# EAGLE design 12F629_prog (EAGLE 9.5.2)
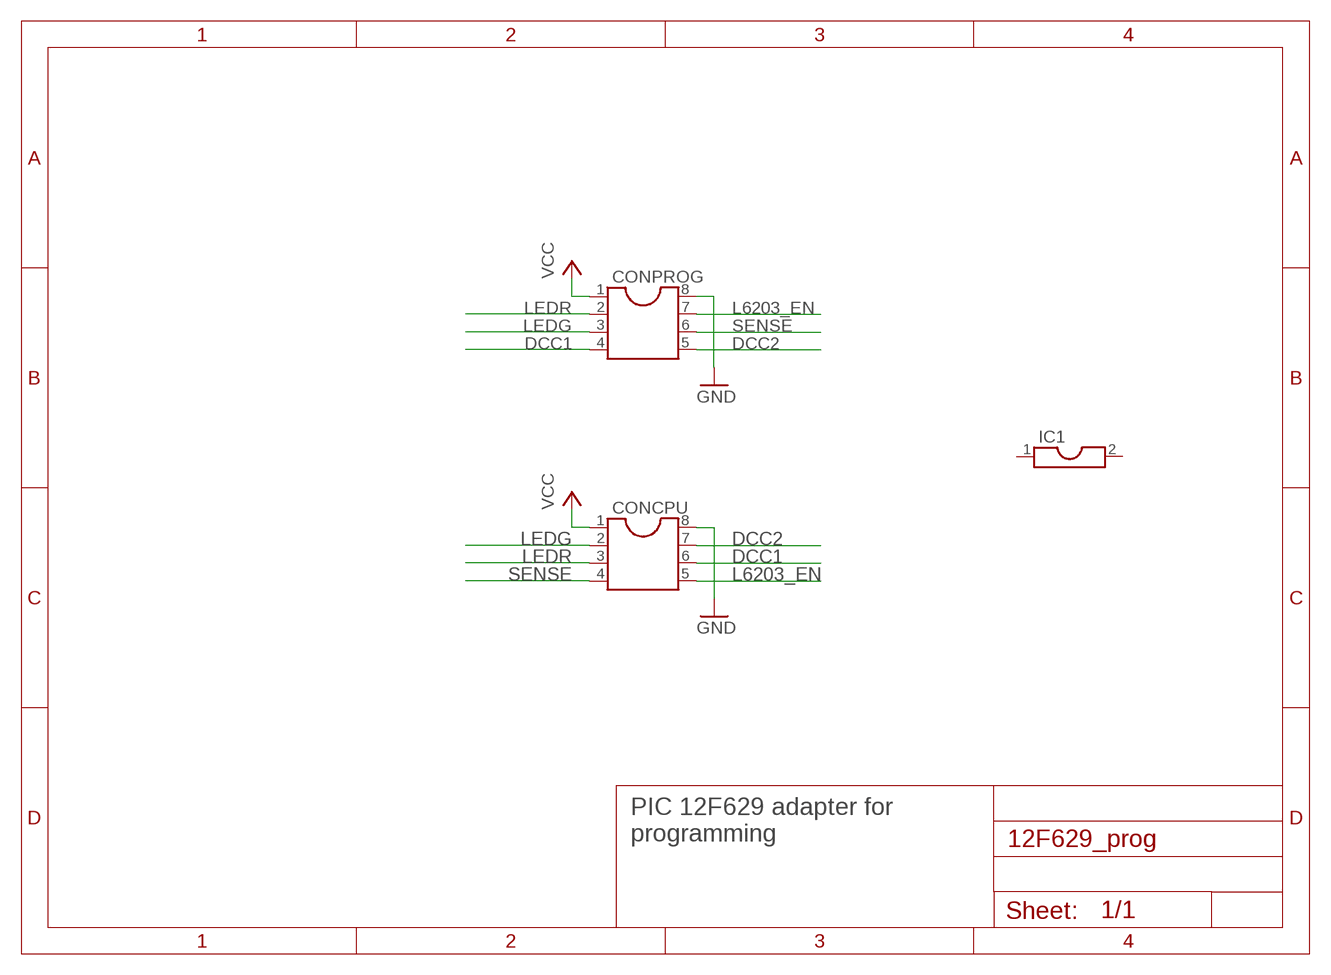
[diagram p0: schematic, sheet 1]

## Parts
CONCPU  DIL8  [DIL08]
CONPROG  DIL8  [DIL08]
IC1  DIL2  [DIL02]

## Nets
DCC1: CONCPU.6 CONPROG.4
DCC2: CONCPU.7 CONPROG.5
GND: CONCPU.8 CONPROG.8
L6203_EN: CONCPU.5 CONPROG.7
LEDG: CONCPU.2 CONPROG.3
LEDR: CONCPU.3 CONPROG.2
SENSE: CONCPU.4 CONPROG.6
VCC: CONCPU.1 CONPROG.1
Unconnected: IC1.1 IC1.2

## Notes on the sheet
- PIC 12F629 adapter for
  programming

## Library data of the parts
CONCPU CONPROG = ic-package-edited:DIL8: Dual In Line / Socket
IC1 = ic-package-edited:DIL2: Dual In Line

## Net classes
0 default: width 0.305 mm

## Board
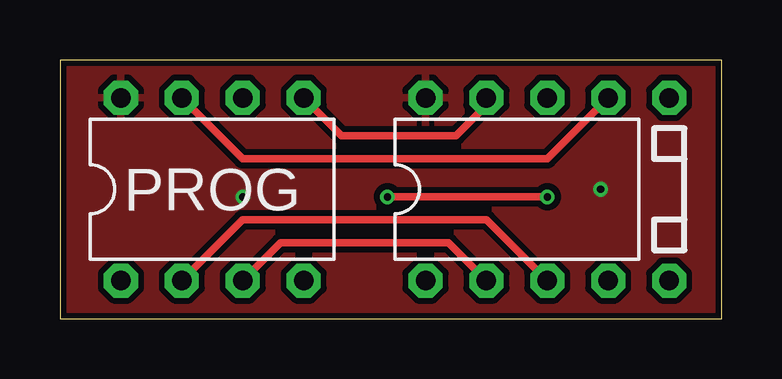
[diagram p1: board, top side]
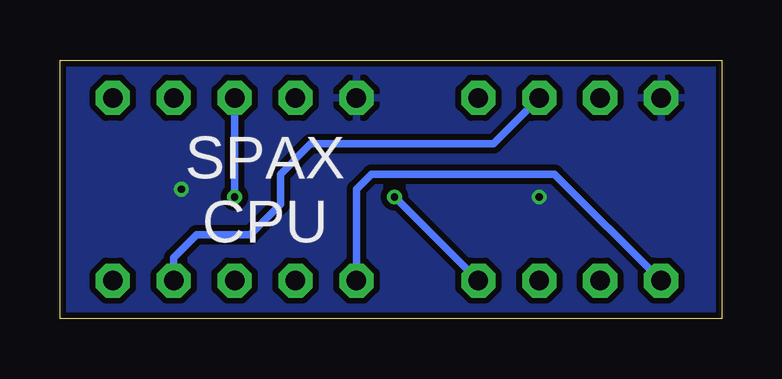
[diagram p2: board, bottom side, seen from below]

Size 27.6 x 10.78 mm. Coordinates in mm from the lower left corner, seen from the top.
Outline: 0,0 27.6,0 27.6,10.78 0,10.78 0,0
Copper layers (1*16): Top 0.035mm / dielectric 1.5mm / Bottom 0.035mm
Design rules "SeeedStudio_2layer_DRU_no_angle_20140221": minimum track width 6mil, minimum drill 12mil, track to track 6mil, track to pad 6mil, pad to pad 6mil, via to via 6mil, smd to smd 0mil, copper to edge 10mil, drill to drill 10mil, minimum pad ring 10mil, minimum via ring 6mil, stop-mask expansion 2mil, vias tented up to drill 100mil, thermal gap 10mil

### Footprints (pad centres in the part's own frame; a part is rotated, then mirrored left to right if it is on the bottom)
DIL08 = drill 0.813 pad 1.422 octagon: 1 -3.81,-3.81; 2 -1.27,-3.81; 3 1.27,-3.81; 4 3.81,-3.81; 5 3.81,3.81; 6 1.27,3.81; 7 -1.27,3.81; 8 -3.81,3.81
DIL02 = drill 0.813 pad 1.422 octagon: 1 0,-3.81; 2 0,3.81

### Placement (x,y rotation side)
CONCPU  19.05,5.4 0 top
CONPROG  6.35,5.4 0 top
IC1  25.4,5.4 0 top

### Tracks (layer width: path | path; a pad name or v marks a point on that pad's centre or on a via)
DCC1  (via drill 0.3)
  Top 0.305: v13.65,5.08 v20.32,5.08
  Bottom 0.305: CONPROG.4 v13.65,5.08 | v20.32,5.08 CONCPU.6
DCC2
  Top 0.305: CONCPU.7 17.78,8.89 16.51,7.62 11.75,7.62 CONPROG.5
GND  (via drill 0.3)
  other vias: 7.62,5.08 22.54,5.4
  pour Bottom (isolate 0.254): 0,0 0,10.79 27.62,10.79 27.62,0
  pour Top (isolate 0.254): 0,0 0,10.79 27.62,10.79 27.62,0
L6203_EN
  Top 0.305: CONPROG.7 7.62,6.67 20.32,6.67 CONCPU.5
LEDG
  Top 0.305: CONPROG.3 9.21,3.17 16.19,3.17 CONCPU.2
LEDR
  Top 0.305: CONPROG.2 7.62,4.13 17.78,4.13 CONCPU.3
SENSE
  Bottom 0.305: CONPROG.6 9.53,7.3 17.14,7.3 18.41,6.03 18.41,4.76 19.68,3.49 21.91,3.49 22.86,2.54 CONCPU.4
VCC
  Bottom 0.305: CONPROG.1 6.99,6.03 14.61,6.03 15.24,5.4 CONCPU.1

### Text on the board
tNames: PROG
bNames: SPAX / CPU